# EAGLE design waga_can (EAGLE 7.7.0)

## Sheet 1 of 2
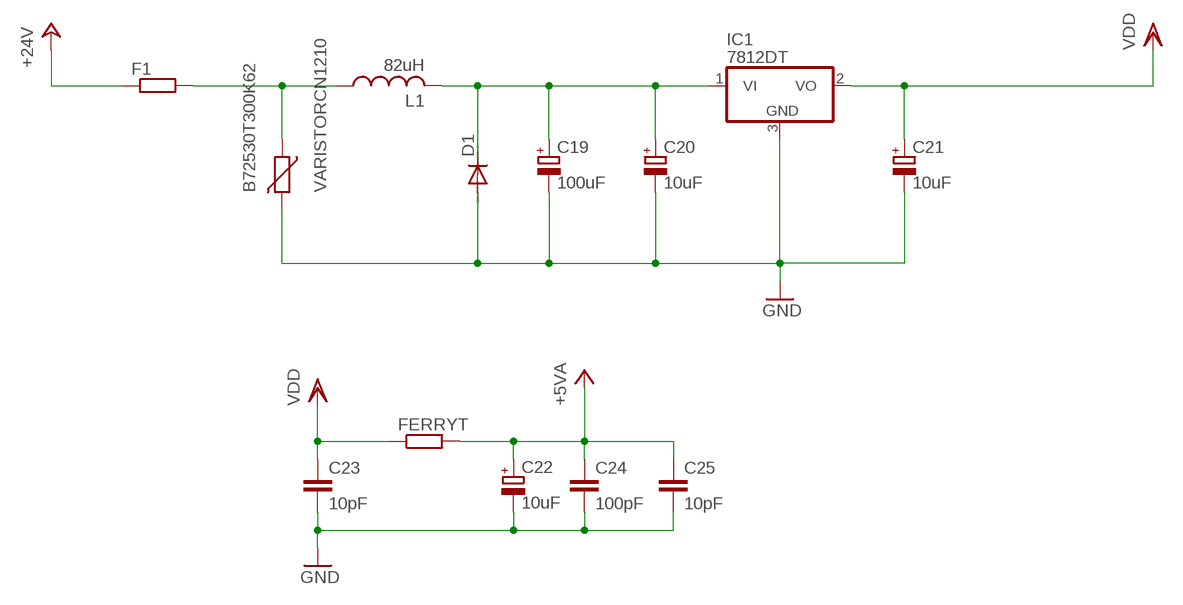
[diagram p0: schematic, sheet 1]

### Parts
B72530T300K62  VARISTORCN1210  [CT/CN1210]
C19  100uF  CPOL-EU153CLV-0810  [153CLV-0810]
C20  10uF  CPOL-EU153CLV-0605  [153CLV-0605]
C21  10uF  CPOL-EU153CLV-0605  [153CLV-0605]
C22  10uF  CPOL-EU153CLV-0605  [153CLV-0605]
C23  10pF  C-EUC0805  [C0805]
C24  100pF  C-EUC0805  [C0805]
C25  10pF  C-EUC0805  [C0805]
D1  DIODE-SMB  [SMB]
F1  R-EU_1812X7R  [1812X7R]
FERRYT  R-EU_M0805  [M0805]
IC1  7812DT  [TO252]
L1  82uH  L-USL4532P  [L4532P]

### Nets
+5V: C22.+ C24.1 C25.1 FERRYT.2 ; supply symbol labelled +5VA ; also sheet 2
+24V: F1.1 ; also sheet 2
GND: B72530T300K62.2 C19.- C20.- C21.- C22.- C23.2 C24.2 C25.2 D1.A IC1.3(GND) ; also sheet 2
N$1: C19.+ C20.+ D1.C IC1.1(VI) L1.2
N$2: B72530T300K62.1 F1.2 L1.1
VDD: C21.+ C23.1 FERRYT.1 IC1.2(VO) ; also sheet 2

## Sheet 2 of 2
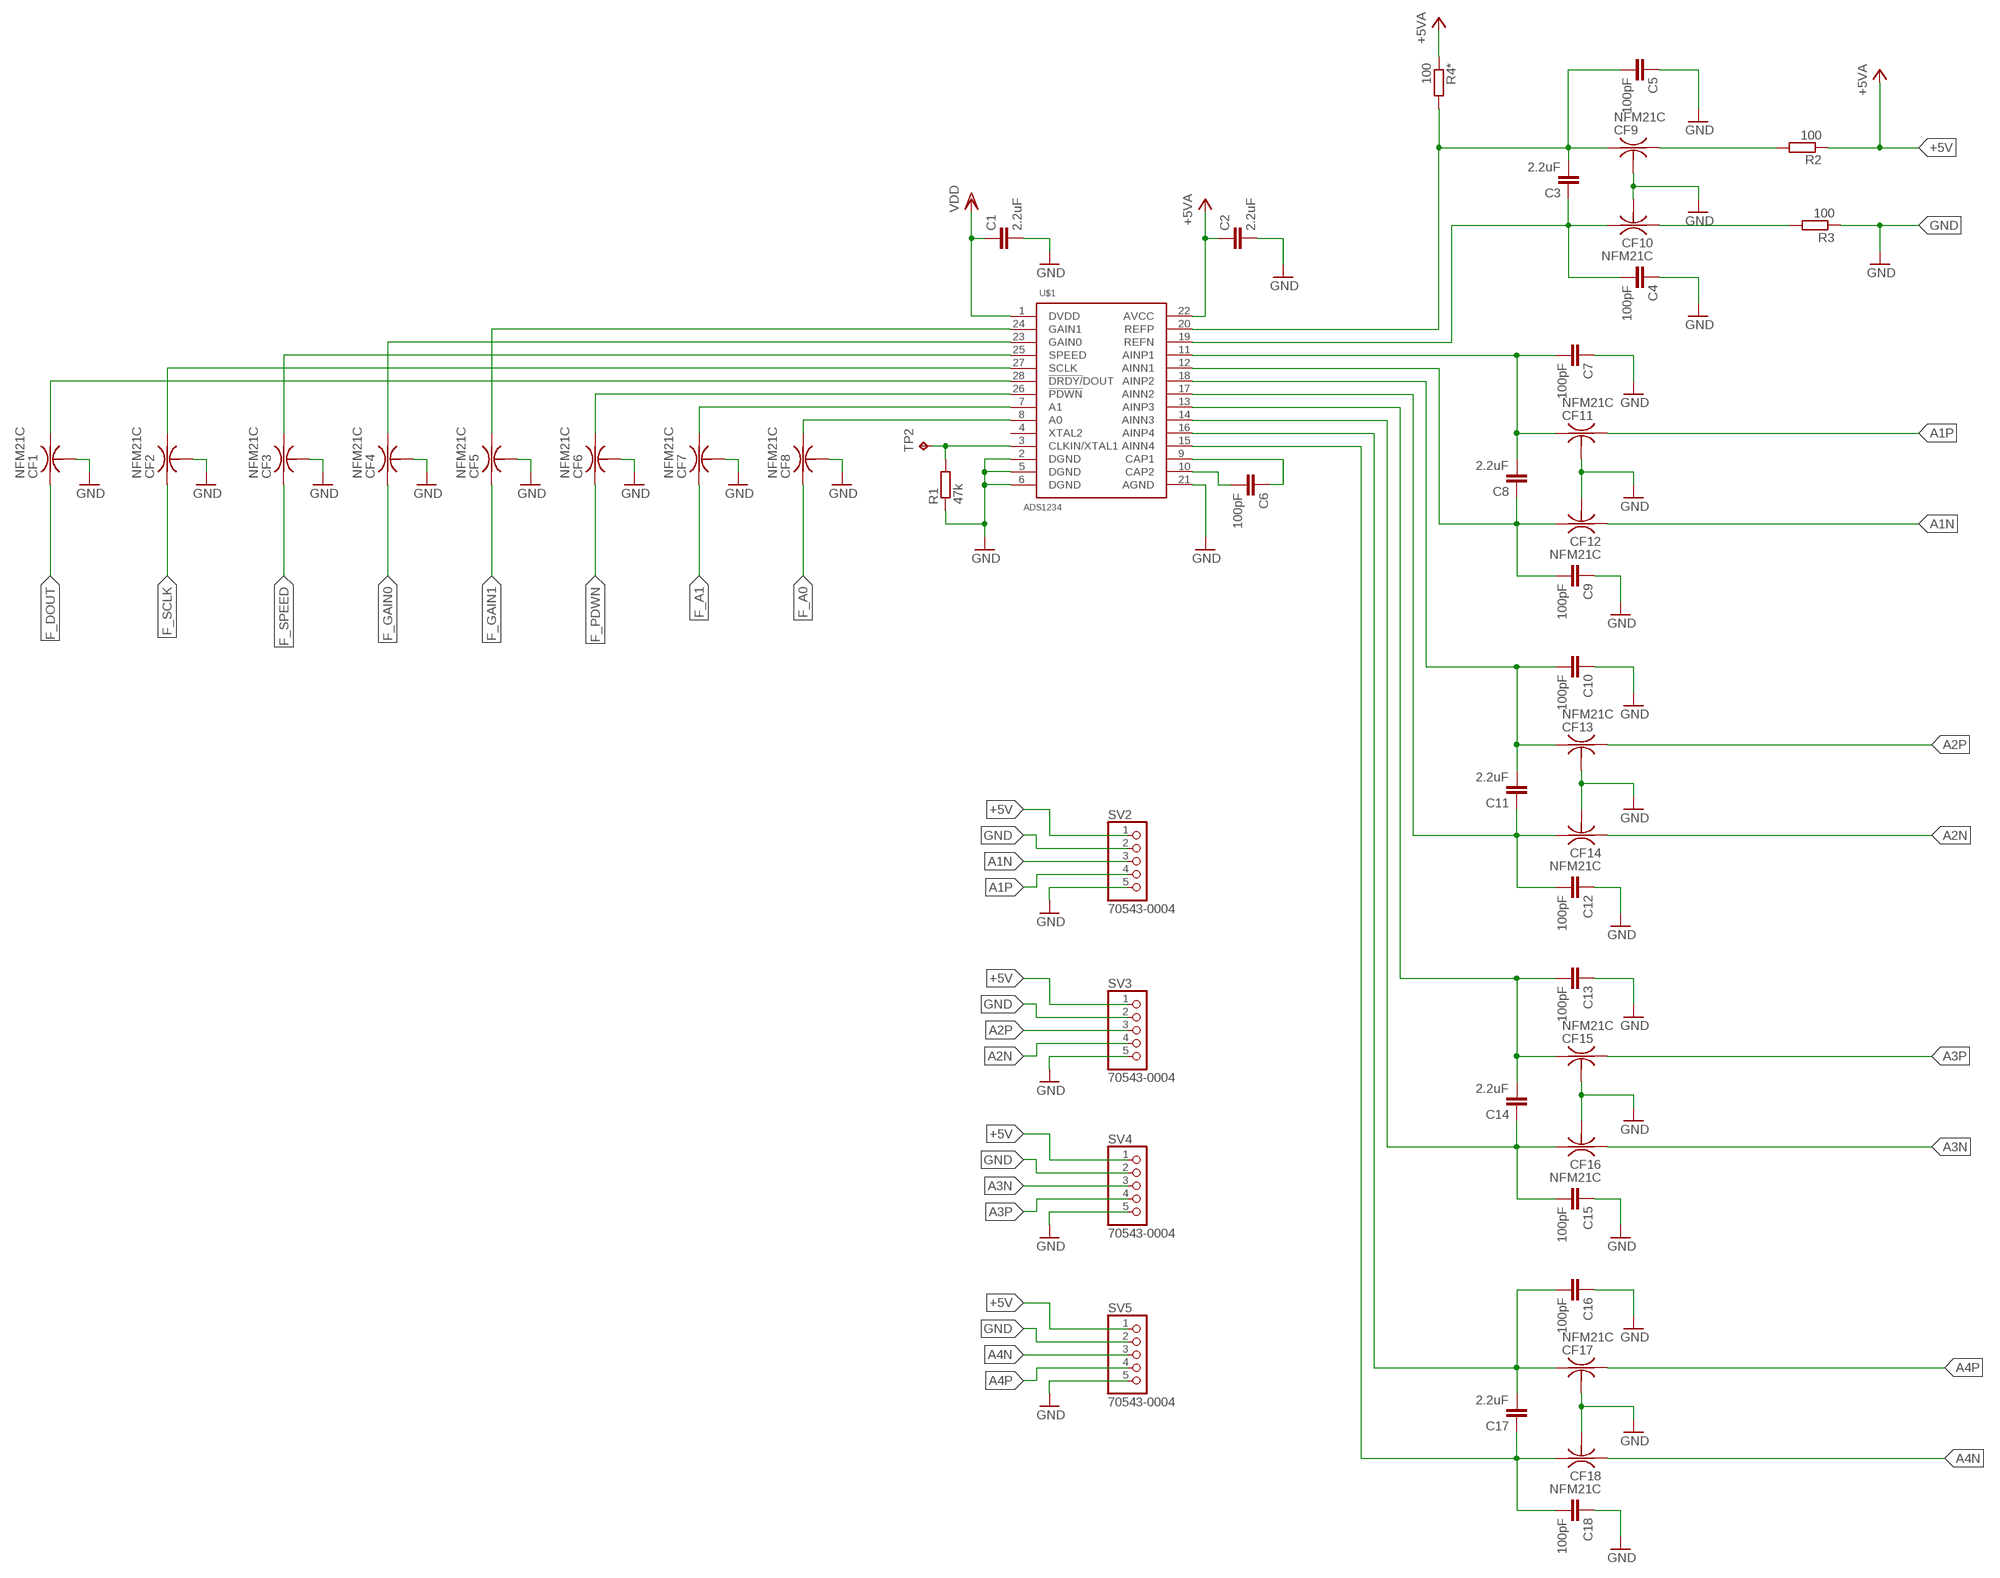
[diagram p1: schematic, sheet 2, part 1 of 2]
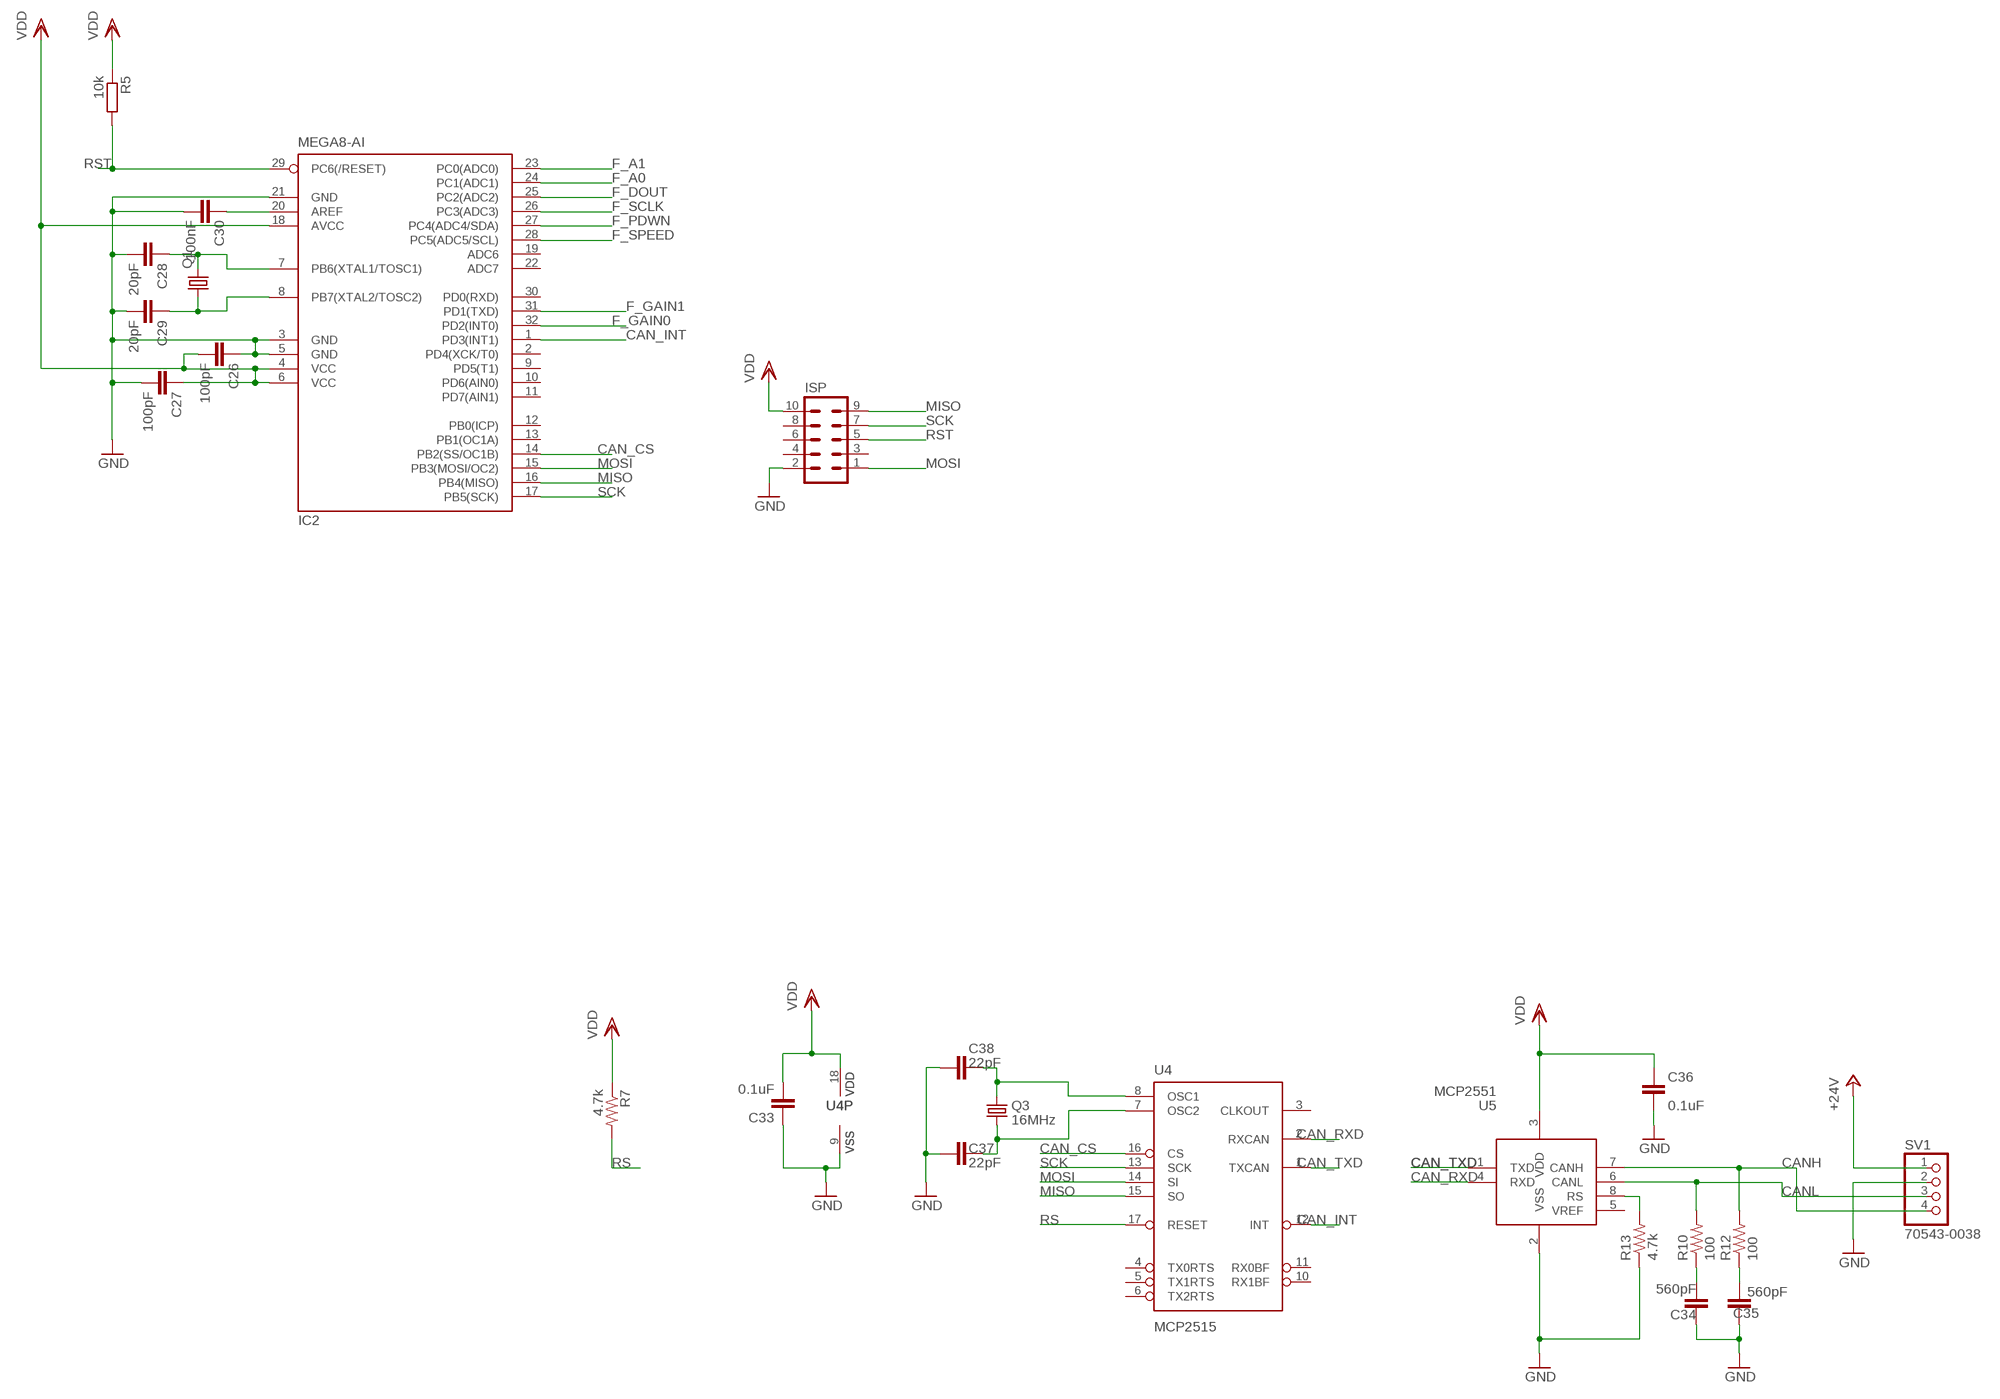
[diagram p2: schematic, sheet 2, part 2 of 2]

### Parts
C1  2.2uF  C-EUC0805K  [C0805K]
C2  2.2uF  C-EUC0805K  [C0805K]
C3  2.2uF  C-EUC0805K  [C0805K]
C4  100pF  C-EUC0603  [C0603]
C5  100pF  C-EUC0603  [C0603]
C6  100pF  C-EUC0603  [C0603]
C7  100pF  C-EUC0603  [C0603]
C8  2.2uF  C-EUC0805K  [C0805K]
C9  100pF  C-EUC0603  [C0603]
C10  100pF  C-EUC0603  [C0603]
C11  2.2uF  C-EUC0805K  [C0805K]
C12  100pF  C-EUC0603  [C0603]
C13  100pF  C-EUC0603  [C0603]
C14  2.2uF  C-EUC0805K  [C0805K]
C15  100pF  C-EUC0603  [C0603]
C16  100pF  C-EUC0603  [C0603]
C17  2.2uF  C-EUC0805K  [C0805K]
C18  100pF  C-EUC0603  [C0603]
C26  100pF  C-EUC0805K  [C0805K]
C27  100pF  C-EUC0805K  [C0805K]
C28  20pF  C-EUC0805K  [C0805K]
C29  20pF  C-EUC0805K  [C0805K]
C30  100nF  C-EUC0805K  [C0805K]
C33  0.1uF  CAP0603-CAP  [0603-CAP]
C34  560pF  CAP0603-CAP  [0603-CAP]
C35  560pF  CAP0603-CAP  [0603-CAP]
C36  0.1uF  CAP0603-CAP  [0603-CAP]
C37  22pF  CAP0603-CAP  [0603-CAP]
C38  22pF  CAP0603-CAP  [0603-CAP]
CF1  NFM21C  [NFM21C]
CF2  NFM21C  [NFM21C]
CF3  NFM21C  [NFM21C]
CF4  NFM21C  [NFM21C]
CF5  NFM21C  [NFM21C]
CF6  NFM21C  [NFM21C]
CF7  NFM21C  [NFM21C]
CF8  NFM21C  [NFM21C]
CF9  NFM21C  [NFM21C]
CF10  NFM21C  [NFM21C]
CF11  NFM21C  [NFM21C]
CF12  NFM21C  [NFM21C]
CF13  NFM21C  [NFM21C]
CF14  NFM21C  [NFM21C]
CF15  NFM21C  [NFM21C]
CF16  NFM21C  [NFM21C]
CF17  NFM21C  [NFM21C]
CF18  NFM21C  [NFM21C]
IC2  MEGA8-AI  [TQFP32-08]
ISP  ML10  [ML10]
Q1  CRYSTALCTS406  [CTS406]
Q3  16MHz  CRYSTAL5X3  [CRYSTAL-SMD-5X3]
R1  47k  R-EU_R0805  [R0805]
R2  100  R-EU_R0805  [R0805]
R3  100  R-EU_R0805  [R0805]
R4*  100  R-EU_R0805  [R0805]
R5  10k  R-EU_R0805  [R0805]
R7  4.7k  RESISTOR0603-RES  [0603-RES]
R10  100  RESISTOR0603-RES  [0603-RES]
R12  100  RESISTOR0603-RES  [0603-RES]
R13  4.7k  RESISTOR0603-RES  [0603-RES]
SV1  70543-0038  [70543-0038]
SV2  70543-0004  [70543-0004]
SV3  70543-0004  [70543-0004]
SV4  70543-0004  [70543-0004]
SV5  70543-0004  [70543-0004]
TP2  TPTP06R  [TP06R]
U4  MCP2515  MCP2510SO  [SO-18W]
U5  MCP2551  [SO-08M]
U$1  ADS1234  [TSSOP-28]

### Nets
+5V: C2.1 R2.1 R4*.1 SV2.1 SV3.1 SV4.1 SV5.1 U$1.22(AVCC) ; supply symbol labelled +5VA ; also sheet 1
+24V: SV1.1 ; also sheet 1
A0: CF8.3 U$1.8(A0)
A1: CF6.3 U$1.26(!PDWN)
A1N: CF12.1 SV2.3
A1P: CF11.3 SV2.4
A2N: CF14.1 SV3.4
A2P: CF13.3 SV3.3
A3N: CF16.1 SV4.3
A3P: CF15.3 SV4.4
A4N: CF18.1 SV5.3
A4P: CF17.3 SV5.4
CAN_CS: IC2.14(PB2(SS/OC1B)) U4.16(CS)
CAN_INT: IC2.1(PD3(INT1)) U4.12(INT)
CAN_RXD: U4.2(RXCAN) U5.4(RXD)
CAN_TXD: U4.1(TXCAN) U5.1(TXD)
CANH: R12.2 SV1.4 U5.7(CANH)
CANL: R10.2 SV1.3 U5.6(CANL)
DOUT: CF1.3 U$1.28(!DRDY/!DOUT)
F_A0: CF8.1 IC2.24(PC1(ADC1))
F_A1: CF7.1 IC2.23(PC0(ADC0))
F_DOUT: CF1.1 IC2.25(PC2(ADC2))
F_GAIN0: CF4.1 IC2.32(PD2(INT0))
F_GAIN1: CF5.1 IC2.31(PD1(TXD))
F_PDWN: CF6.1 IC2.27(PC4(ADC4/SDA))
F_SCLK: CF2.1 IC2.26(PC3(ADC3))
F_SPEED: CF3.1 IC2.28(PC5(ADC5/SCL))
GAIN0: CF4.3 U$1.23(GAIN0)
GAIN1: CF5.3 U$1.24(GAIN1)
GND: C1.2 C2.2 C4.1 C5.1 C7.1 C9.1 C10.1 C12.1 C13.1 C15.1 C16.1 C18.1 C26.1 C27.2 C28.2 C29.2 C30.2 C33.1 C34.1 C35.1 C36.1 C37.1 C38.1 CF1.2@1 CF1.2@2 CF2.2@1 CF2.2@2 CF3.2@1 CF3.2@2 CF4.2@1 CF4.2@2 CF5.2@1 CF5.2@2 CF6.2@1 CF6.2@2 CF7.2@1 CF7.2@2 CF8.2@1 CF8.2@2 CF9.2@1 CF9.2@2 CF10.2@1 CF10.2@2 CF11.2@1 CF11.2@2 CF12.2@1 CF12.2@2 CF13.2@1 CF13.2@2 CF14.2@1 CF14.2@2 CF15.2@1 CF15.2@2 CF16.2@1 CF16.2@2 CF17.2@1 CF17.2@2 CF18.2@1 CF18.2@2 IC2.3(GND) IC2.5(GND) IC2.21(GND) ISP.2 R1.1 R3.1 R13.1 SV1.2 SV2.2 SV2.5 SV3.2 SV3.5 SV4.2 SV4.5 SV5.2 SV5.5 U4.9(VSS) U5.2(VSS) U$1.2(DGND) U$1.5(DGND) U$1.6(DGND) U$1.21(AGND) ; also sheet 1
MISO: IC2.16(PB4(MISO)) ISP.9 U4.15(SO)
MOSI: IC2.15(PB3(MOSI/OC2)) ISP.1 U4.14(SI)
N$3: C30.1 IC2.20(AREF)
N$5: C34.2 R10.1
N$7: CF7.3 U$1.7(A1)
N$8: C28.1 IC2.7(PB6(XTAL1/TOSC1)) Q1.3
N$9: R1.2 TP2.TP U$1.3(CLKIN/XTAL1)
N$10: C29.1 IC2.8(PB7(XTAL2/TOSC2)) Q1.1
N$11: C3.2 C5.2 CF9.1 R4*.2 U$1.20(REFP)
N$12: C3.1 C4.2 CF10.3 U$1.19(REFN)
N$14: C14.1 C15.2 CF16.3 U$1.14(AINN3)
N$15: CF9.3 R2.2
N$16: CF10.1 R3.2
N$17: C6.2 U$1.10(CAP2)
N$18: C6.1 U$1.9(CAP1)
N$19: C35.2 R12.1
N$21: C7.2 C8.2 CF11.1 U$1.11(AINP1)
N$22: C8.1 C9.2 CF12.3 U$1.12(AINN1)
N$23: C10.2 C11.2 CF13.1 U$1.18(AINP2)
N$24: C11.1 C12.2 CF14.3 U$1.17(AINN2)
N$25: R13.2 U5.8(RS)
N$27: C13.2 C14.2 CF15.1 U$1.13(AINP3)
N$29: C38.2 Q3.3 U4.8(OSC1)
N$31: C37.2 Q3.1 U4.7(OSC2)
N$35: C16.2 C17.2 CF17.1 U$1.16(AINP4)
N$37: C17.1 C18.2 CF18.3 U$1.15(AINN4)
RS: R7.2 U4.17(RESET)
RST: IC2.29(PC6(/RESET)) ISP.5 R5.2
SCK: IC2.17(PB5(SCK)) ISP.7 U4.13(SCK)
SCLK: CF2.3 U$1.27(SCLK)
SPEED: CF3.3 U$1.25(SPEED)
VDD: C1.1 C26.2 C27.1 C33.2 C36.2 IC2.4(VCC) IC2.6(VCC) IC2.18(AVCC) ISP.10 R5.1 R7.1 U4.18(VDD) U5.3(VDD) U$1.1(DVDD) ; also sheet 1
Unconnected: IC2.2(PD4(XCK/T0)) IC2.9(PD5(T1)) IC2.10(PD6(AIN0)) IC2.11(PD7(AIN1)) IC2.12(PB0(ICP)) IC2.13(PB1(OC1A)) IC2.19(ADC6) IC2.22(ADC7) IC2.30(PD0(RXD)) ISP.3 ISP.4 ISP.6 ISP.8 U4.3(CLKOUT) U4.4(TX0RTS) U4.5(TX1RTS) U4.6(TX2RTS) U4.10(RX1BF) U4.11(RX0BF) U5.5(VREF) U$1.4(XTAL2)

## Library data of the parts
B72530T300K62 = varistor:VARISTOR: VARISTOR
C1-C18 C23-C30 = rcl:C-EU: CAPACITOR, European symbol
C19-C22 = rcl:CPOL-EU: POLARIZED CAPACITOR, European symbol
C33-C38 = SparkFun:CAP: Capacitor Standard 0603 ceramic capacitor, and 0.1" leaded capacitor.
CF1-CF18 = murata-filter:NFM: EMIFIL(R) (Capacitor type) Single Circuit Type for Signal Lines Source: http://search.murata.co.jp/Ceramy/image/img/PDF/ENG/L0111S0109NFM3DC.pdf; MPN: NFM21CC102R1H3D; OC_FARNELL: 1828795; OC_NEWARK: 84R0165
D1 = diode:DIODE-: DIODE
F1 FERRYT R1-R3 R4* R5 = rcl:R-EU_: RESISTOR, European symbol
IC1 = linear:78*: Positive VOLTAGE REGULATOR Source: http://cache.national.com/ds/LM/LM78L05.pdf http://www.fairchildsemi.com/ds/LM/LM7805.pdf
IC2 = atmel:MEGA8: MICROCONTROLLER 8 Kbytes FLASH, 1 kbytes SRAM, 512 bytes EEPROM, USART, 6-channel 10 bit ADC, 2-channel 8 bit ADC Pin compatible with Atmega48, ATMega88, ATMega168 Source: avr.lbr; MPN: ATMEGA8-16AU; OC_FARNELL: 9171371; OC_NEWARK: 73M8863
ISP = con-ml:ML10: HARTING; OC_FARNELL: unknown; OC_NEWARK: unknown
L1 = rcl:L-US: INDUCTOR, American symbol
Q1 = crystal:CRYSTAL: CRYSTAL; OC_FARNELL: unknown; OC_NEWARK: unknown
Q3 = SparkFun:CRYSTAL: Crystals Various standard crystals. Proven footprints. Spark Fun Electronics SKU : COM-00534
R7 R10 R12 R13 = SparkFun:RESISTOR: Resistor Basic schematic elements and footprints for 0603, 1206, and PTH resistors.
SV1 = molex-con:70543-0038
SV2-SV5 = molex-con:70543-0004
TP2 = testpad:TP: Test pad
U4 = microchip_can:MCP2510
U5 = skpang_lib:MCP2551
U$1 = TI-ads1234:ADS1234

## Board
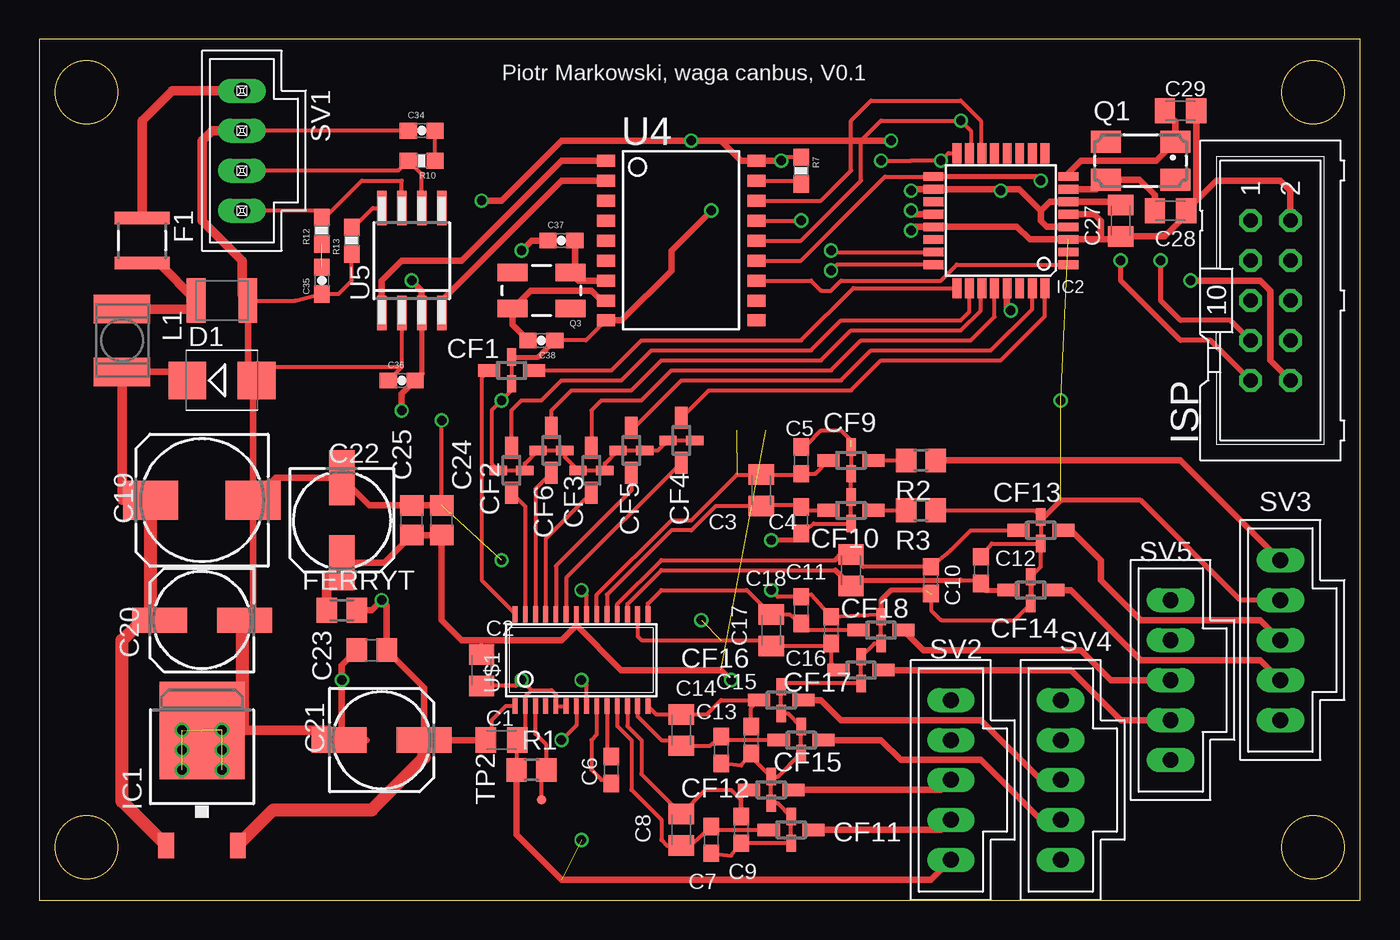
[diagram p3: board, top side]
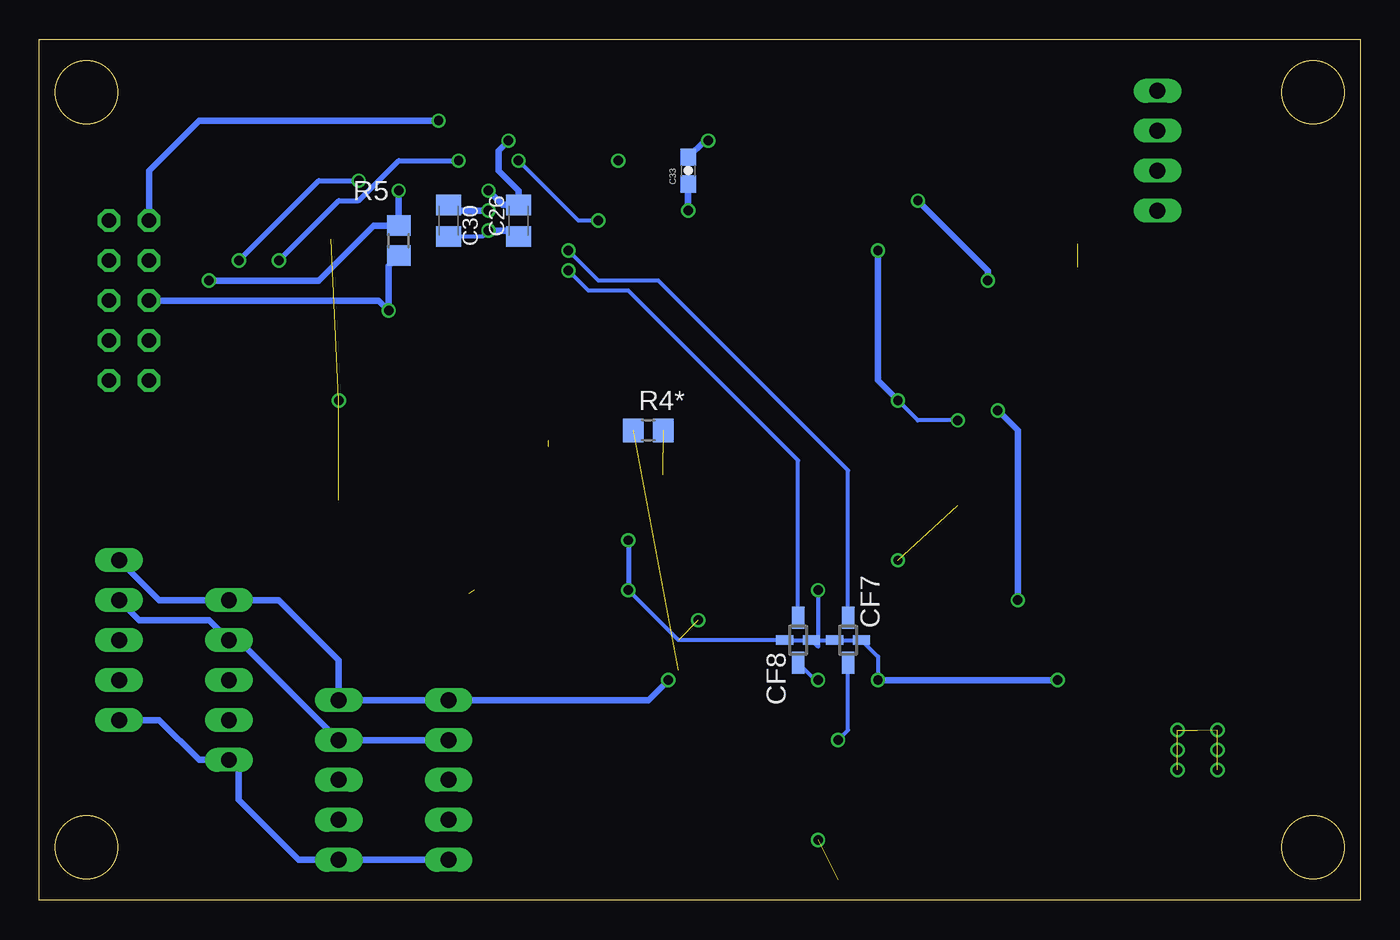
[diagram p4: board, bottom side, seen from below]

Size 84 x 54.73 mm. Coordinates in mm from the lower left corner, seen from the top.
Outline: 84,54.73 0,54.73 0,0 84,0 84,54.73
Outline: circle at 3,3.37 radius 2
Outline: circle at 81,51.37 radius 2
Outline: circle at 3,51.37 radius 2
Outline: circle at 81,3.37 radius 2
Copper layers (1*16): Top 0.035mm / dielectric 1.5mm / Bottom 0.035mm
Design rules "NOA Eagle Rule 2016-06-12": minimum track width 6mil, minimum drill 0.3mm, track to track 6mil, track to pad 6mil, pad to pad 6mil, via to via 6mil, smd to smd 0mil, copper to edge 0.4mm, drill to drill 10mil, minimum pad ring 10mil, minimum via ring 6mil, stop-mask expansion 2mil, vias tented up to drill 25mil, thermal gap 10mil

### Footprints (pad centres in the part's own frame; a part is rotated, then mirrored left to right if it is on the bottom)
CT/CN1210 = smd 1.2 x 2.8: 1 -1.65,0; 2 1.65,0
C0805K = smd 1.3 x 1.6: 1 -1,0; 2 1,0
C0603 = smd 1.1 x 1: 1 -0.85,0; 2 0.85,0
153CLV-0810 = smd 3.5 x 2.5: + 3.25,0; - -3.25,0
153CLV-0605 = smd 3.5 x 1.6: + 2.7,0; - -2.7,0
C0805 = smd 1.3 x 1.5: 1 -0.95,0; 2 0.95,0
0603-CAP = smd 1.1 x 1: 1 -0.85,0; 2 0.85,0
NFM21C = smd 1.4 x 0.8: 1 -1.425,0; 3 1.425,0 | smd 0.6 x 1.1: 2@1 0,-0.85; 2@2 0,0.85
SMB = smd 2.4 x 2.4: A 2.2,0; C -2.2,0
1812X7R = smd 0.8 x 3.5: 1 -1.425,0; 2 1.425,0
M0805 = smd 1.3 x 1.6: 1 -0.95,0; 2 0.95,0
TO252 = smd 1 x 1.6: 1 -2.28,-4.8; 2 2.28,-4.8 | smd 5.4 x 6.2: 3 0,2.5
TQFP32-08 = smd 1.27 x 0.559: 1 -4.293,2.8; 2 -4.293,2; 3 -4.293,1.2; 4 -4.293,0.4; 5 -4.293,-0.4; 6 -4.293,-1.2; 7 -4.293,-2; 8 -4.293,-2.8; 17 4.293,-2.8; 18 4.293,-2; 19 4.293,-1.2; 20 4.293,-0.4; 21 4.293,0.4; 22 4.293,1.2; 23 4.293,2; 24 4.293,2.8 | smd 0.559 x 1.27: 9 -2.8,-4.293; 10 -2,-4.293; 11 -1.2,-4.293; 12 -0.4,-4.293; 13 0.4,-4.293; 14 1.2,-4.293; 15 2,-4.293; 16 2.8,-4.293; 25 2.8,4.293; 26 2,4.293; 27 1.2,4.293; 28 0.4,4.293; 29 -0.4,4.293; 30 -1.2,4.293; 31 -2,4.293; 32 -2.8,4.293
ML10 = drill 0.914 octagon: 1 -5.08,-1.27; 2 -5.08,1.27; 3 -2.54,-1.27; 4 -2.54,1.27; 5 0,-1.27; 6 0,1.27; 7 2.54,-1.27; 8 2.54,1.27; 9 5.08,-1.27; 10 5.08,1.27
L4532P = smd 1.8 x 3.6: 1 -2,0; 2 2,0
CTS406 = smd 1.9 x 1.4: 1 -2.2,-1.2; 2 2.2,-1.2; 3 2.2,1.2; 4 -2.2,1.2
CRYSTAL-SMD-5X3 = smd 1.9 x 1.1: 1 -1.85,-1.15; 2 1.85,-1.15; 3 1.85,1.15; 4 -1.85,1.15
R0805 = smd 1.3 x 1.5: 1 -0.95,0; 2 0.95,0
0603-RES = smd 1.1 x 1: 1 -0.85,0; 2 0.85,0
70543-0038 = drill 1.016 long: 1 -3.81,0; 2 -1.27,0; 3 1.27,0; 4 3.81,0
70543-0004 = drill 1.016 long: 1 -5.08,0; 2 -2.54,0; 3 0,0; 4 2.54,0; 5 5.08,0
TP06R = smd 0.6 x 0.6: TP 0,0
SO-18W = smd 0.762 x 1.143: 1 -5.08,-4.788; 2 -3.81,-4.788; 3 -2.54,-4.788; 4 -1.27,-4.788; 5 0,-4.788; 6 1.27,-4.788; 7 2.54,-4.788; 8 3.81,-4.788; 9 5.08,-4.788; 10 5.08,4.788; 11 3.81,4.788; 12 2.54,4.788; 13 1.27,4.788; 14 0,4.788; 15 -1.27,4.788; 16 -2.54,4.788; 17 -3.81,4.788; 18 -5.08,4.788
SO-08M = smd 0.6 x 2.2: 1 -1.905,-3.33; 2 -0.635,-3.33; 3 0.635,-3.33; 4 1.905,-3.33; 5 1.905,3.33; 6 0.635,3.33; 7 -0.635,3.33; 8 -1.905,3.33
TSSOP-28 = smd 0.305 x 0.991: 1 -4.225,-2.918; 2 -3.575,-2.918; 3 -2.925,-2.918; 4 -2.275,-2.918; 5 -1.625,-2.918; 6 -0.975,-2.918; 7 -0.325,-2.918; 8 0.325,-2.918; 9 0.975,-2.918; 10 1.625,-2.918; 11 2.275,-2.918; 12 2.925,-2.918; 13 3.575,-2.918; 14 4.225,-2.918; 15 4.225,2.918; 16 3.575,2.918; 17 2.925,2.918; 18 2.275,2.918; 19 1.625,2.918; 20 0.975,2.918; 21 0.325,2.918; 22 -0.325,2.918; 23 -0.975,2.918; 24 -1.625,2.918; 25 -2.275,2.918; 26 -2.925,2.918; 27 -3.575,2.918; 28 -4.225,2.918

### Placement (x,y rotation side)
B72530T300K62  11.62,38.13 0 top
C1  29.4,10.19 0 top
C2  28.13,14.63 270 top
C3  45.91,26.06 90 top
C4  48.45,24.16 90 top
C5  48.45,27.97 270 top
C6  36.38,8.28 90 top
C7  42.73,3.84 90 top
C8  40.83,4.47 270 top
C9  44.64,4.47 90 top
C10  56.7,20.35 90 top
C11  51.62,20.98 90 top
C12  59.88,20.98 270 top
C13  43.37,9.55 90 top
C14  40.83,10.82 270 top
C15  45.27,10.19 90 top
C16  50.35,17.17 270 top
C17  46.54,17.17 270 top
C18  48.45,18.44 270 top
C19  10.35,25.43 180 top
C20  10.35,17.81 180 top
C21  21.78,10.19 0 top
C22  19.24,24.16 270 top
C23  21.14,15.9 180 top
C24  25.59,24.16 90 top
C25  23.68,24.16 90 top
C26  53.53,43.21 90 bottom
C27  68.77,43.21 270 top
C28  71.94,43.84 0 top
C29  72.58,50.19 0 top
C30  57.97,43.21 270 bottom
C33  42.73,46.38 90 bottom
C34  24.32,48.92 0 top
C35  17.97,39.4 90 top
C36  23.05,33.05 0 top
C37  33.21,41.94 0 top
C38  31.94,35.59 180 top
CF1  30.03,33.68 180 top
CF2  30.03,27.33 270 top
CF3  35.11,27.33 270 top
CF4  40.83,29.24 270 top
CF5  37.65,28.6 270 top
CF6  32.57,28.6 270 top
CF7  32.57,16.54 270 bottom
CF8  35.75,16.54 270 bottom
CF9  51.62,27.97 0 top
CF10  51.62,24.79 180 top
CF11  47.81,4.47 0 top
CF12  46.54,7.01 180 top
CF13  63.69,23.52 0 top
CF14  63.05,19.71 180 top
CF15  48.45,10.19 0 top
CF16  47.18,12.73 180 top
CF17  52.26,14.63 0 top
CF18  53.53,17.17 180 top
D1  11.62,33.05 0 top
F1  6.54,41.94 270 top
FERRYT  19.24,18.44 180 top
IC1  10.35,8.28 0 top
IC2  61.15,43.21 180 top
ISP  78.29,38.13 270 top
L1  5.27,35.59 270 top
Q1  70.04,47.02 180 top
Q3  31.94,38.76 180 top
R1  31.3,8.28 0 top
R2  56.07,27.97 180 top
R3  56.07,24.79 180 top
R4*  45.27,29.87 0 bottom
R5  61.15,41.94 270 bottom
R7  48.45,46.38 270 top
R10  24.32,47.02 180 top
R12  17.97,42.57 90 top
R13  19.87,41.94 90 top
SV1  12.89,47.65 270 top
SV2  57.97,7.65 270 top
SV3  78.93,16.54 270 top
SV4  64.96,7.65 270 top
SV5  71.94,14 270 top
TP2  31.94,6.38 90 top
U4  40.83,41.94 270 top
U5  23.68,40.67 0 top
U$1  34.48,15.27 0 top

### Tracks (layer width: path | path; a pad name or v marks a point on that pad's centre or on a via)
+5V  (via drill 0.6)  (1 unrouted)
  Top 0.254: 34.15,17.48 U$1.22 | C2.1 28.13,16.54
  Top 0.406: SV3.1 72.58,27.97 R2.1 | C22.+ 21.93,21.46 C25.1 C24.1 25.59,17.81 26.86,16.54 28.13,16.54 33.21,16.54 34.15,17.48 37,14.63 43.37,14.63 v44,14
  Top 0.61: FERRYT.2 18.29,20.51 C22.+
  Bottom 0.406: SV3.1 76.39,19.08 SV5.1 68.77,19.08 64.96,15.27 SV4.1 SV2.1 45.27,12.73 v44,14
+24V
  Top 0.61: SV1.1 8.44,51.46 6.54,49.56 F1.1
A0  (via drill 0.6)
  Top 0.254: U$1.8 34.8,13.67 v34.48,14
  Bottom 0.254: v34.48,14 34.63,14 CF8.3
A1
  Top 0.254: CF6.3 31.55,26.16 U$1.26
A1N
  Top 0.254: CF12.1 47.97,6.86
  Top 0.406: CF12.1 57.34,7.01 SV2.3
A1P
  Top 0.406: CF11.3 57.34,4.47 SV2.4
A2N
  Top 0.406: SV3.4 77.66,15.27 70.04,15.27 65.59,19.71 CF14.1
A2P
  Top 0.406: SV3.3 77.66,17.81 70.04,17.81 67.5,20.35 67.5,21.62 65.59,23.52 CF13.3
A3N
  Top 0.406: CF16.1 49.72,12.73 50.99,11.46 59.88,11.46 63.69,7.65 SV4.3
A3P
  Top 0.254: CF15.3 49.87,10.03
  Top 0.406: CF15.3 53.53,10.19 54.8,8.92 59.88,8.92 63.69,5.11 SV4.4
A4N
  Top 0.406: CF18.1 56.22,15.9 66.23,15.9 68.13,14 SV5.3
A4P
  Top 0.254: CF17.3 53.68,14.48
  Top 0.406: CF17.3 65.59,14.63 68.77,11.46 SV5.4
CAN_CS
  Top 0.254: U4.16 49.72,44.48 51.62,46.38 51.62,49.56 52.89,50.83 58.61,50.83 59.88,49.56 59.88,47.57 IC2.14
CAN_INT
  Top 0.254: U4.12 49.08,39.4 49.72,38.76 50.35,38.76 50.99,39.4 57.34,39.4 58.35,40.41 IC2.1
CAN_RXD
  Top 0.406: U4.2 33.21,45.75 25.59,38.13 U5.4
CAN_TXD
  Top 0.406: U4.1 33.21,47.02 26.86,40.67 23.05,40.67 21.78,39.4 U5.1
CANH
  Top 0.254: U5.7 23.05,45.75 20.51,45.75 18.18,43.42 R12.2 17.55,43.84 SV1.4
CANL
  Top 0.254: U5.6 24.32,46.17 R10.2 22.83,46.38 SV1.3
DOUT
  Top 0.254: CF1.3 28.13,33.2 28.13,20.35 30.25,18.22 U$1.28
F_A0  (via drill 0.6)
  Top 0.254: IC2.24 50.73,40.41 v50.35,40.03
  Bottom 0.254: CF8.1 35.75,27.97 46.54,38.76 49.08,38.76 v50.35,40.03
F_A1  (via drill 0.6)
  Top 0.254: v50.35,41.3 50.45,41.21 | 50.45,41.21 IC2.23 | 50.26,41.21 50.45,41.21
  Bottom 0.254: CF7.1 32.57,27.33 44.64,39.4 48.45,39.4 v50.35,41.3
F_DOUT
  Top 0.254: 31.3,33.53 CF1.1 36.38,33.68 38.29,35.59 48.45,35.59 51.77,38.91 IC2.25
F_GAIN0
  Top 0.254: IC2.32 63.95,37.12 61.15,34.32 53.53,34.32 51.62,32.41 42.58,32.41 CF4.1 40.98,30.51
F_GAIN1
  Top 0.254: CF5.1 37.81,30.03 40.83,33.05 50.99,33.05 52.89,34.95 60.51,34.95 63.15,37.59 IC2.31
F_PDWN
  Top 0.254: CF6.1 32.57,31.14 33.84,32.41 37.65,32.41 39.56,34.32 49.72,34.32 51.62,36.22 58.61,36.22 59.88,37.49 59.88,38.84 IC2.27
F_SCLK
  Top 0.254: CF2.1 30.03,31.14 30.67,31.78 31.94,31.78 33.21,33.05 37.02,33.05 38.92,34.95 49.08,34.95 50.99,36.86 58.61,36.86 59.15,37.4 IC2.26
F_SPEED
  Top 0.254: IC2.28 60.75,37.09 59.24,35.59 52.26,35.59 50.35,33.68 40.19,33.68 38.29,31.78 35.75,31.78 35.11,31.14 CF3.1
GAIN0
  Top 0.254: CF4.3 33.5,20.49 U$1.23
GAIN1
  Top 0.254: CF5.3 37.65,26.06 32.85,21.26 U$1.24
GND  (via drill 0.6)  (13 unrouted)
  Top 0.254: 31.3,13.36 30.9,12.96 U$1.2 30.9,10.69 C1.2 30.4,8.33 R1.1 | 31.3,13.36 32.57,13.36 32.85,13.08 U$1.5 U$1.6 | CF1.2@1 CF1.2@2 30.03,32.41 v29.4,31.78 28.76,31.14 28.76,27.75 CF2.2@1 CF2.2@2 30.88,27.76 CF6.2@1 CF6.2@2 33.42,28.17 CF3.2@1 CF3.2@2 35.96,27.76 CF5.2@1 CF5.2@2 39.34,28.6 CF4.2@1 CF4.2@2 | v30.67,14 31.3,13.36 | 30.35,13.68 v30.67,14 | C4.1 49.23,23.94 CF10.2@2 CF10.2@1 CF9.2@1 51.62,29.24 50.99,29.87 49.72,29.87 48.81,28.97 C5.1 48.35,28.87 | C7.1 44,2.84 C9.1 CF11.2@1 CF11.2@2 46.97,6.16 CF12.2@2 CF12.2@1 | CF14.2@1 63.69,21.2 CF13.2@1 | CF13.2@1 63.69,24.16 CF13.2@2 63.27,24.79 R3.1 57.34,24.47 | C12.1 60.57,22.67 CF13.2@1 | C15.1 44.64,8.55 C13.1 | 45.42,9.34 C15.1 | C15.1 45.27,9.13 CF12.2@1 | CF12.2@1 46.97,7.86 CF15.2@1 CF15.2@2 47.61,11.88 CF16.2@2 CF16.2@1 47.38,13.78 CF17.2@1 CF17.2@2 53.1,16.32 CF18.2@2 CF18.2@1 53.38,18.17 C16.1 49.08,19.44 C18.1 46.96,19.29 v46.54,19.71 46.81,19.44 | C10.1 56.7,18.44 57.34,17.81 62,17.81 CF14.2@2 | U$1.21 34.8,19.4 v34.48,19.71 | v30.67,14 30.3,13.63 C2.2 | U4.9 34.77,35.59 C38.1 | U5.2 23.05,33.9 | 23.05,33.9 C36.1 | B72530T300K62.2 16.28,38.13 C35.1 19.02,38.55 19.87,39.4 R13.1 | 23.05,33.9 14.67,33.9 D1.A | C34.1 SV1.2 | C24.2 v25.59,30.51
  Top 0.305: CF1.2@1 31.73,34.53 C38.1 | CF14.2@1 CF14.2@2 | 56.34,19.71 54.16,19.71 53.53,19.08 CF18.2@1 | SV3.2 76.39,19.08 70.04,25.43 64.96,25.43 63.69,24.16 | C4.1 48.45,22.89 v46.54,22.89
  Top 0.406: 12.89,38.13 B72530T300K62.2 13.27,33.05 13.6,33.05 | 13.6,33.05 D1.A | C19.- 13.6,33.05 | C19.- 13.6,17.81 C20.- | 20.83,10.19 19.24,10.19 | 19.24,10.19 C21.- | 67.5,42.01 68.57,42.01 C27.2 71.58,42.21 72.58,43.21 72.58,43.48 C28.2 73.58,44.48 | 67.5,42.01 IC2.3 62.98,42.01 62.18,42.81 IC2.21 55.67,42.81 v55.43,42.57 | IC2.5 67.1,43.61 67.5,43.21 67.5,42.01 | C29.2 73.58,44.48 | 19.24,10.19 v19.24,14 19.24,14.95 C23.2 | ISP.2 79.56,45.11 78.93,45.75 74.85,45.75 73.58,44.48 | R1.1 30.35,4.15 33.21,1.3 56.7,1.3 SV2.5 | C19.- 15.03,26.86 C22.- 20.99,25.11 C25.2 C24.2 | v42.73,43.84 40.19,41.3 40.19,40.03 37.02,36.86 U4.9 | C37.1 31.3,41.94 v30.67,41.3
  Top 0.61: SV1.2 10.98,48.92 10.35,48.29 10.35,43.21 12.89,40.67 12.89,38.51 B72530T300K62.2 | C21.- 18.44,10.82 12.89,10.82
  Top 0.813: IC1.3 10.39,10.82 12.89,10.82 12.89,17.1 13.6,17.81
  Bottom 0.254: C30.2 55.8,42.21 v55.43,42.57 | CF8.2@2 CF8.2@1 43.37,16.54 v46.54,19.71 | CF8.2@2 CF7.2@1 CF7.2@2 30.67,15.48 v30.67,14 | v34.48,19.71 34.48,16.12 CF8.2@2 | v25.59,30.51 28.13,30.51 v29.4,31.78
  Bottom 0.305: v46.54,22.89 v46.54,19.71
  Bottom 0.406: v55.43,42.57 53.89,42.57 C26.1 | SV2.5 SV4.5 67.5,2.57 71.31,6.38 71.31,8.28 SV5.5 73.85,8.92 76.39,11.46 SV3.5 | v30.67,14 v19.24,14 | SV2.2 SV4.2 71.31,16.54 SV5.2 73.21,17.81 77.66,17.81 SV3.2 | C33.1 v42.73,43.84 | v30.67,41.3 30.67,33.05 v29.4,31.78
  other vias: 34.48,3.84 64.96,31.78 11.62,8.28 9.08,8.28 9.08,9.55 9.08,10.82 11.62,9.55 11.62,10.82 42.1,17.81 29.4,21.62
MISO  (via drill 0.6)
  Top 0.254: U4.15 v48.45,43.21 | IC2.16 57.82,47.5 v57.34,47.02 55.43,47.02 v53.53,47.02
  Top 0.305: ISP.9 74.48,35.59 72.58,35.59 68.77,39.4 v68.77,40.67
  Bottom 0.254: v48.45,43.21 49.72,43.21 v53.53,47.02
  Bottom 0.305: v68.77,40.67 64.96,44.48 63.69,44.48 61.15,47.02 v57.34,47.02
MOSI  (via drill 0.6)
  Top 0.254: U4.14 48.45,41.94 52.26,45.75 52.26,48.29 53.53,49.56 v58.61,49.56 59.24,48.92 59.24,47.59 IC2.15
  Bottom 0.406: ISP.1 77.02,46.38 73.85,49.56 v58.61,49.56
N$1
  Top 0.406: D1.C 9.42,33.59 L1.2 | 5.27,25.43 C19.+
  Top 0.61: L1.2 5.27,25.43
  Top 0.813: IC1.1 5.27,6.28 5.27,16.54 6.54,17.81 C20.+ 7.1,18.36 C19.+
N$2
  Top 0.406: 10.35,38.13 B72530T300K62.1 9.97,37.59 | F1.2 7.58,40.51
  Top 0.61: 9.97,37.59 L1.1 | 7.58,40.51 B72530T300K62.1
N$3  (via drill 0.6)
  Top 0.406: IC2.20 55.67,43.61 v55.43,43.84
  Bottom 0.406: v55.43,43.84 57.61,43.84 C30.1
N$5
  Top 0.254: R10.1 C34.2
N$7  (via drill 0.6)
  Top 0.254: U$1.7 34.15,11.13 v33.21,10.19
  Bottom 0.254: v33.21,10.19 32.57,10.82 CF7.3
N$8
  Top 0.406: IC2.7 67.23,45.21 Q1.3 69.97,45.82 70.94,44.84 C28.1
N$9
  Top 0.254: U$1.3 31.55,10.57 32.25,9.87 R1.2 31.94,7.97 TP2.TP
N$10
  Top 0.406: C29.1 72.24,49.53 Q1.1 71.04,47.02 66.23,47.02 65.44,46.23 IC2.8
N$11  (1 unrouted)
  Top 0.254: U$1.20 35.45,19.42 40.19,24.16 41.46,24.16 44.37,27.06 C3.2 48.35,27.06 C5.2 49.35,27.12 CF9.1
N$12
  Top 0.254: CF10.3 48.81,24.79 C4.2 48.3,25.16 46,25.16 C3.1 43,25.06 41.46,23.52 40.19,23.52 36.1,19.43 U$1.19
N$14
  Top 0.254: C15.2 45.27,12.25 CF16.3 43.37,12.73 42.46,11.82 C14.1 39.23,11.82 U$1.14
N$15
  Top 0.254: CF9.3 R2.2
N$16
  Top 0.254: CF10.1 R3.2
N$17
  Top 0.254: U$1.10 36.1,9.56 C6.2
N$18
  Top 0.254: U$1.9 35.45,10.53 35.11,10.19 35.11,8.28 35.75,7.65 36.02,7.65 C6.1
N$19  (1 unrouted)
N$21
  Top 0.254: CF11.1 43.1,4.47 C7.2 41.37,3.47 C8.2 39.92,3.47 39.56,3.84 39.56,5.11 37.65,7.01 37.65,10.19 36.75,11.09 U$1.11
N$22
  Top 0.254: CF12.3 44.64,6.53 C9.2 44.64,6.38 44,7.01 42.37,7.01 C8.1 38.29,8.01 38.29,10.19 37.4,11.07 U$1.12
N$23
  Top 0.254: U$1.18 36.75,18.81 39.56,21.62 50.62,21.62 | CF13.1 59.24,23.52 57.97,22.25 C10.2 52.41,21.2 C11.2
  Top 0.305: 50.62,21.62 50.99,21.98 C11.2
N$24
  Top 0.254: U$1.17 37.4,18.83 39.56,20.98 50.62,20.98 | 58.61,20.35 59.66,20.35 C12.2
  Top 0.305: 50.62,20.98 C11.1 51.99,20.35 58.61,20.35 | C12.2 60.15,19.71 CF14.3
N$25
  Top 0.254: R13.2 19.93,42.73 21.2,44 U5.8
N$27
  Top 0.254: CF15.1 43.73,10.19 C13.2 42.64,9.82 C14.2 40.46,10.19 39.56,10.19 38.05,11.69 U$1.13
N$29
  Top 0.406: U4.8 35.75,38.13 35.11,38.76 31.24,38.76 Q3.3 30.09,36.59 C38.2
N$31
  Top 0.406: U4.7 34.3,39.4 Q3.1 34.06,40.18 C37.2
N$35
  Top 0.254: CF17.1 50.35,15.11 C16.2 50.2,16.17 C17.2 46.18,16.54 38.29,16.54 38.05,16.77 U$1.16
N$37
  Top 0.254: CF18.3 48.72,17.17 C18.2 47.72,18.17 C17.1 45,19.71 39.56,19.71 38.7,18.86 U$1.15
RS
  Top 0.254: U4.17 48.23,45.75 R7.2
RST  (via drill 0.6)
  Top 0.406: IC2.29 61.55,37.73 v61.78,37.49
  Bottom 0.406: R5.2 61.78,40.35 v61.78,37.49 62.42,38.13 ISP.5
SCK  (via drill 0.6)
  Top 0.254: U4.13 48.45,40.67 53.79,46.01 IC2.17
  Top 0.305: ISP.7 75.75,36.86 72.58,36.86 71.31,38.13 v71.31,40.67 | v63.69,45.75 63.43,46.01 IC2.17
  Bottom 0.305: v71.31,40.67 66.23,45.75 v63.69,45.75
SCLK
  Top 0.254: CF2.3 30.9,25.04 U$1.27
SPEED
  Top 0.254: CF3.3 32.2,23 U$1.25
VDD  (via drill 0.6)
  Top 0.254: U$1.1 29.65,12.35 28.76,11.46 28.76,10.55 C1.1 | R7.1 47.39,47.23 v47.18,47.02
  Top 0.305: U5.3 24.32,33.47
  Top 0.406: v28.13,44.48 29.4,44.48 33.21,48.29 v41.46,48.29 43.37,48.29 | 43.37,48.29 44.64,47.02 U4.18 v47.18,47.02 | C27.1 68.57,44.41 IC2.6 64.25,44.41 63.69,43.84 | C36.2 23.68,33.26 | v55.43,45.11 55.53,45.21 IC2.18 61.15,45.21 | IC2.4 64.09,42.81 63.69,43.21 63.69,43.84 | 61.15,45.21 62.32,45.21 63.69,43.84 | v61.15,45.11 61.15,45.21 | C36.2 23.05,32.2 v23.05,31.14 | U5.3 24.32,38.76 v23.68,39.4 | 24.32,33.47 C36.2 | ISP.10 78.29,34.32 78.29,38.76 77.66,39.4 v73.21,39.4 | FERRYT.1 21.14,18.44 v21.78,19.08 22.09,18.76 C23.1 24.48,13.52 C21.+ C1.1 | v54.16,48.29 43.37,48.29
  Top 0.813: IC1.2 14.89,5.74 21.14,5.74 24.48,9.08 C21.+
  Bottom 0.406: v23.68,39.4 23.68,40.03 v28.13,44.48 | v55.43,45.11 54.53,44.21 C26.2 53.53,45.11 54.8,46.38 54.8,47.65 v54.16,48.29 | v61.15,45.11 R5.1 62.74,42.89 66.23,39.4 v73.21,39.4 | v23.05,31.14 21.78,29.87 v21.78,19.08 | C33.2 41.68,48.29 v41.46,48.29

### Text on the board
tNames: Piotr Markowski, waga canbus, V0.1